# Altium schematic sheet Transitorio.SchDoc
size Letter; SheetNumber: 2; SheetTotal: 4
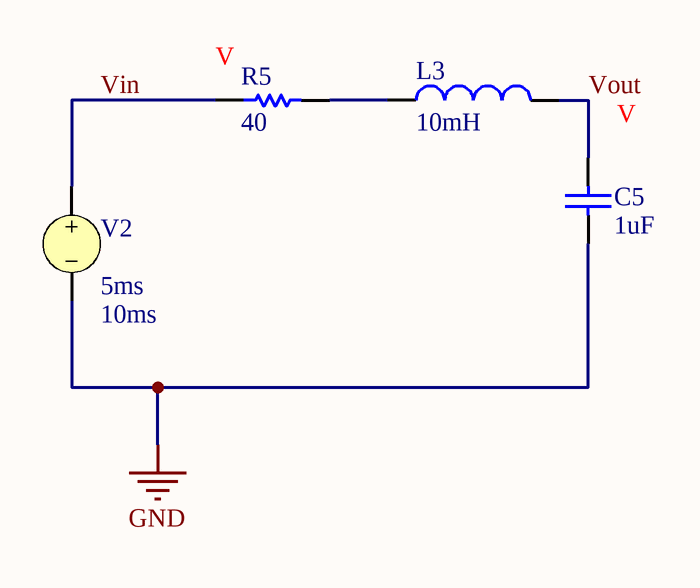
[diagram p0: Transitorio.SchDoc]

## Parts
C5  value 1uF  (hidden comment: Capacitor)
L3  value 10mH  (hidden comment: Inductor)
R5  value 40  (hidden comment: Resistor)
V2  Pulse Width: 5ms  Period: 10ms  (hidden comment: PULSE(0 1 100n 10n 10n 5ms 10ms 0))

## Nets
GND: C5.1 V2.2
Vin: R5.1 V2.1
Vout: C5.2 L3.2
NetL3_1: L3.1 R5.2

## Notes on the sheet
- Proyecto:
- Documento:
- Autor:
- Carnet:
- Fecha:
- Revisión:
- Curso:
- Tamaño:
- Hoja:
- de
- Carta

## Library data of the parts
C5 = Capacitor: SimulationGenericComponent: True
L3 = Inductor: SimulationGenericComponent: True
R5 = Resistor: TC1: 0; SimulationGenericComponent: True; TC2: 0
V2 = VSRC: Voltage Source; Note: PCB Footprint - Not required; AC Magnitude: 1; AC Phase: 0; Published: 8-Jun-2000; LatestRevisionDate: 17-Jul-2002; LatestRevisionNote: Re-released for DXP Platform.; PackageReference: Not Applicable; Publisher: Altium Limited; DC Magnitude: 1; Initial Value: 0; Pulsed Value: 1; Time Delay: 100n; Rise Time: 10n; Fall Time: 10n; Phase: 0